# EAGLE design CCS811_breakout (EAGLE 7.6.0)
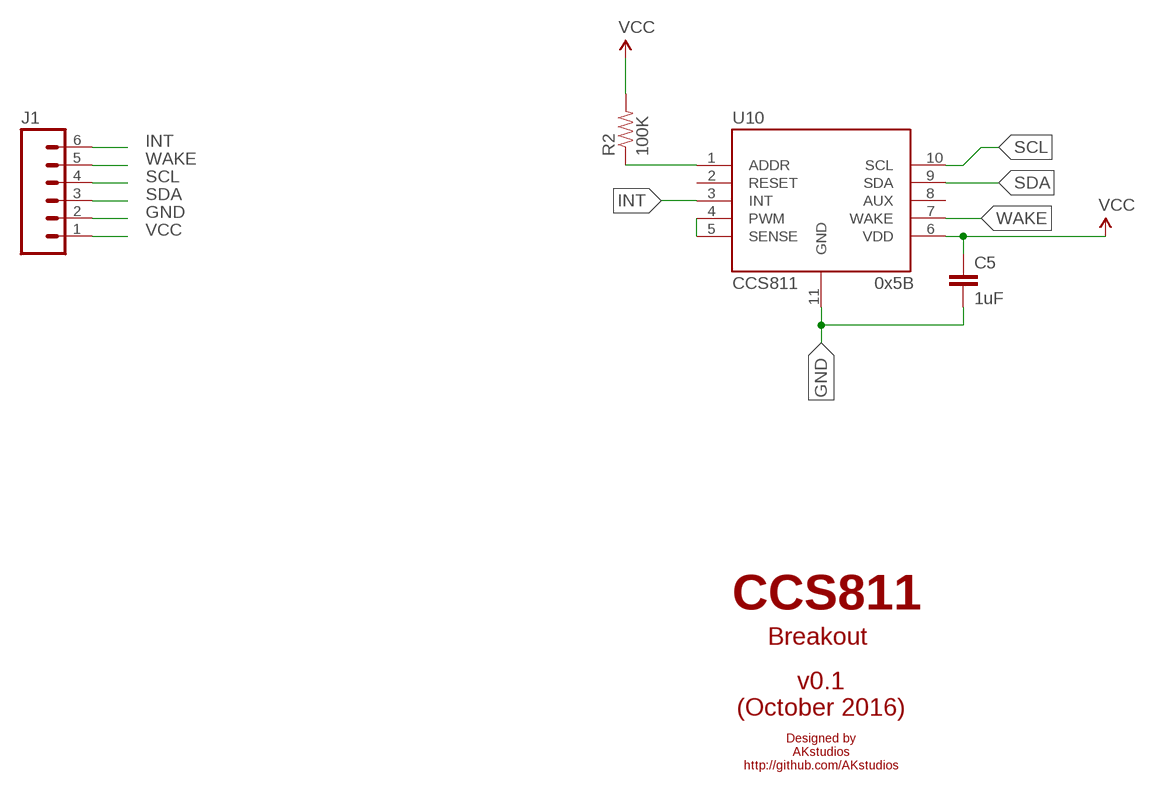
[diagram p0: schematic, sheet 1]

## Parts
C5  1uF  CAP0805  [0805]
J1  M06SILK_FEMALE_PTH  [1X06]
R2  100K  RESISTOR0805-RES  [0805]
U10  CCS811  CCS811-I2C  [LGA]

## Nets
GND: C5.2 J1.2 U10.11(GND)
INT: J1.6 U10.3(INT)
N$1: R2.1 U10.1(ADDR)
N$2: U10.4(PWM) U10.5(SENSE)
SCL: J1.4 U10.10(SCL)
SDA: J1.3 U10.9(SDA)
VCC: C5.1 J1.1 R2.2 U10.6(VDD)
WAKE: J1.5 U10.7(WAKE)
Unconnected: U10.2(RESET) U10.8(AUX)

## Notes on the sheet
- 0x5B
- CCS811
- Breakout
- v0.1
  (October 2016)
- Designed by
  AKstudios
  http://github.com/AKstudios

## Library data of the parts
C5 = SparkFun-Passives:CAP: Capacitor Standard 0603 ceramic capacitor, and 0.1" leaded capacitor.; OC_NEWARK: unknown
J1 = SparkFun-Connectors:M06: Header 6 Standard 6-pin 0.1" header. Use with straight break away headers (SKU : PRT-00116), right angle break away headers (PRT-00553), swiss pins (PRT-00743), machine pins (PRT-00117), and female headers (PRT-00115). Molex polarized connector foot print use with SKU : PRT-08094 with associated crimp pins and housings. NOTES ON THE VARIANTS LOCK and LOCK_LONGPADS... This footprint was designed to help hold the alignment of a through-hole component (i.e. 6-pin header) while soldering it into place. You may notice that each hole has been shifted either up or down by 0.005 of an inch from it's more standard position (which is a perfectly straight line). This slight alteration caused the pins (the squares in the middle) to touch the edges of the holes. Because they are alternating, it causes a "brace" to hold the component in place. 0.005 has proven to be the perfect amount of "off-center" position when using our standard breakaway headers. Although looks a little odd when you look at the bare footprint, once you have a header in there, the alteration is very hard to notice. Also,if you push a header all the way into place, it is covered up entirely on the bottom side. This idea of altering the position of holes to aid alignment will be further integrated into the Sparkfun Library for other footprints. It can help hold any component with 3 or more connection pins.; PROD_ID: CONN-08437
R2 = SparkFun-Passives:RESISTOR: Resistor Basic schematic elements and footprints for 0603, 1206, and PTH resistors.; OC_NEWARK: unknown
U10 = CCS811:CCS811

## Board
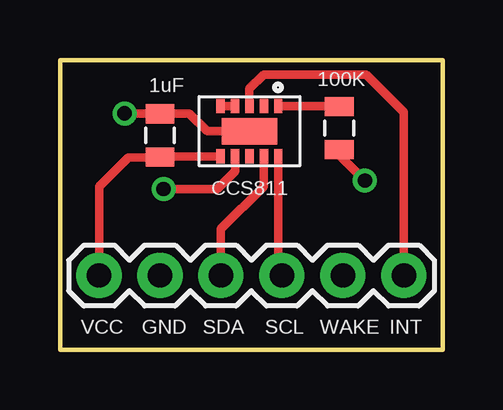
[diagram p1: board, top side]
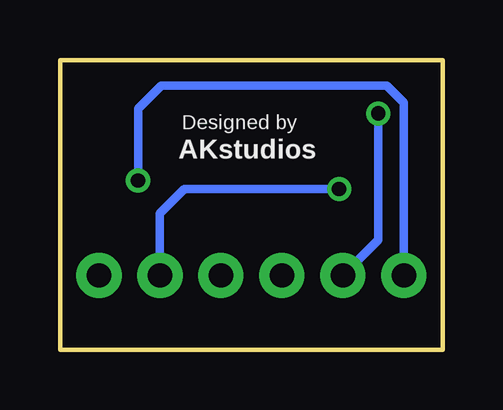
[diagram p2: board, bottom side, seen from below]

Size 15.95 x 12.09 mm. Coordinates in mm from the lower left corner, seen from the top.
Outline: 0,0 15.95,0 15.95,12.09 0,12.09 0,0
Copper layers (1*16): Top 0.035mm / dielectric 1.5mm / Bottom 0.035mm
Design rules "default": minimum track width 10mil, minimum drill 24mil, track to track 8mil, track to pad 8mil, pad to pad 8mil, via to via 8mil, smd to smd 8mil, copper to edge 40mil, drill to drill 8mil, minimum pad ring 10mil, minimum via ring 8mil, stop-mask expansion 4mil, vias tented up to drill 0mil, thermal gap 10mil

### Footprints (pad centres in the part's own frame; a part is rotated, then mirrored left to right if it is on the bottom)
0805 = smd 0.8 x 1.2: 1 -0.9,0; 2 0.9,0
1X06 = drill 1.016 pad 1.88: 1 0,0; 2 2.54,0; 3 5.08,0; 4 7.62,0; 5 10.16,0; 6 12.7,0
LGA = smd 0.6 x 0.35: 1 0.3,3.2; 2 0.3,2.6; 3 0.3,2; 4 0.3,1.4; 5 0.3,0.8; 6 2.4,0.8; 7 2.4,1.4; 8 2.4,2; 9 2.4,2.6; 10 2.4,3.2 | smd 1.1 x 2.3: 11 1.35,2

### Placement (x,y rotation side)
C5  4.17,8.94 90 top
J1  1.63,3.1 0 top
R2  11.63,9.25 270 top
U10  5.89,10.46 270 top

### Tracks (layer width: path | path; a pad name or v marks a point on that pad's centre or on a via)
GND  (via drill 0.6)
  Top 0.356: U10.11 6.13,9.11 5.38,9.86 4.18,9.86 | 4.15,9.86 v2.69,9.86
  Top 0.406: 4.18,9.86 C5.2 4.15,9.86
  Bottom 0.356: v2.69,9.86 2.69,4.57 J1.2
INT
  Top 0.356: U10.3 7.89,10.89 8.48,11.48 12.75,11.48 14.33,9.91 J1.6
N$1
  Top 0.356: U10.1 11.61,10.16 R2.1
N$2
  Top 0.356: U10.5 U10.4
SCL
  Top 0.356: U10.10 9.09,3.25 J1.4
SDA
  Top 0.356: U10.9 8.49,6.82 6.71,5.03 J1.3
VCC  (via drill 0.6)
  Top 0.356: J1.1 1.63,6.81 2.84,8.03 4.15,8.03 | U10.6 4.19,8.06 | R2.2 11.63,8.13 v12.7,7.06
  Top 0.406: 4.15,8.03 C5.1 4.19,8.06
  Bottom 0.356: v12.7,7.06 12.7,10.06 11.73,11.02 2.34,11.02 1.63,10.31 J1.1
WAKE  (via drill 0.6)
  Top 0.356: U10.7 7.29,7.45 6.55,6.71 v4.32,6.71
  Bottom 0.356: v4.32,6.71 10.77,6.71 11.79,5.69 J1.5

### Text on the board
_tsilk: CCS811 | VCC | GND | SDA | SCL | WAKE | INT
_bsilk: Designed by | AKstudios